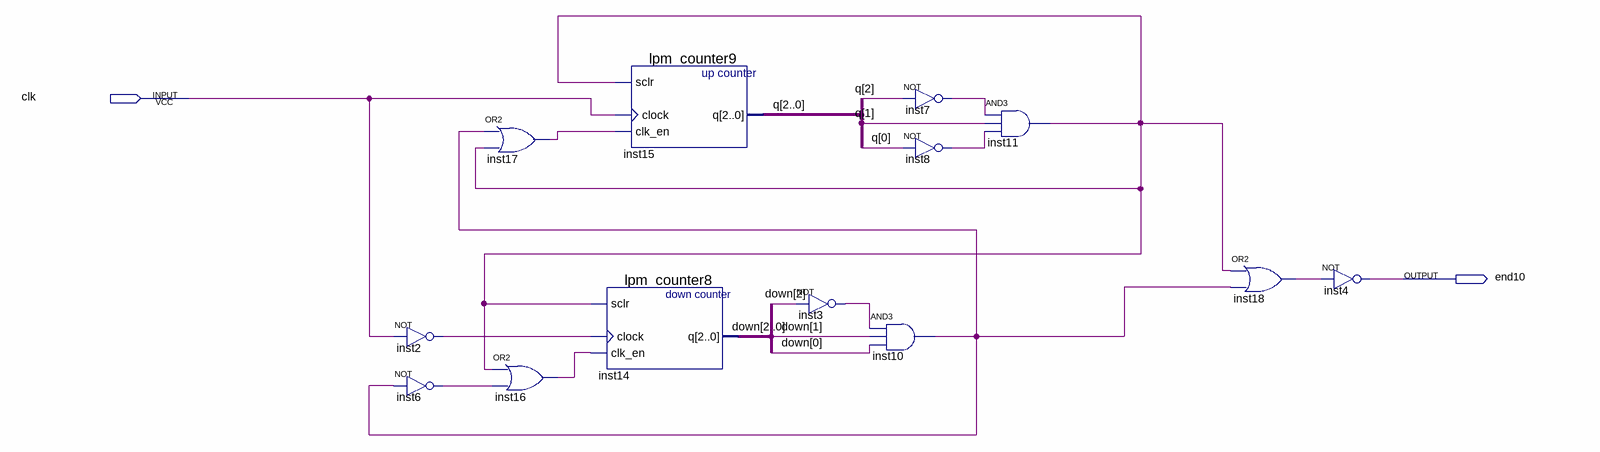
[diagram p0: schematic sheet]
// Quartus schematic block2.bdf as structural Verilog: 13 symbols, 2 pins
module block2 (
  input  clk,
  output end10
);

  wire inst2_out, inst3_out, inst6_out, inst7_out, inst8_out, inst10_out, inst11_out, inst16_out, inst17_out,
       inst18_out;
  wire [2:0] down, q;

  not inst2 (inst2_out, clk);
  not inst6 (inst6_out, inst10_out);
  or inst17 (inst17_out, inst10_out, inst11_out);
  or inst16 (inst16_out, inst11_out, inst6_out);
  lpm_counter9 inst15 (.sclr(inst11_out), .clock(clk), .clk_en(inst17_out), .q(q));
  lpm_counter8 inst14 (.sclr(inst11_out), .clock(inst2_out), .clk_en(inst16_out), .q(down));
  not inst3 (inst3_out, down[2]);
  and inst10 (inst10_out, inst3_out, down[1], down[0]);
  not inst7 (inst7_out, q[2]);
  not inst8 (inst8_out, q[0]);
  and inst11 (inst11_out, inst7_out, q[1], inst8_out);
  or inst18 (inst18_out, inst11_out, inst10_out);
  not inst4 (end10, inst18_out);
endmodule
